# EAGLE design avr-dds-signal-generator-mod (EAGLE 5.09)
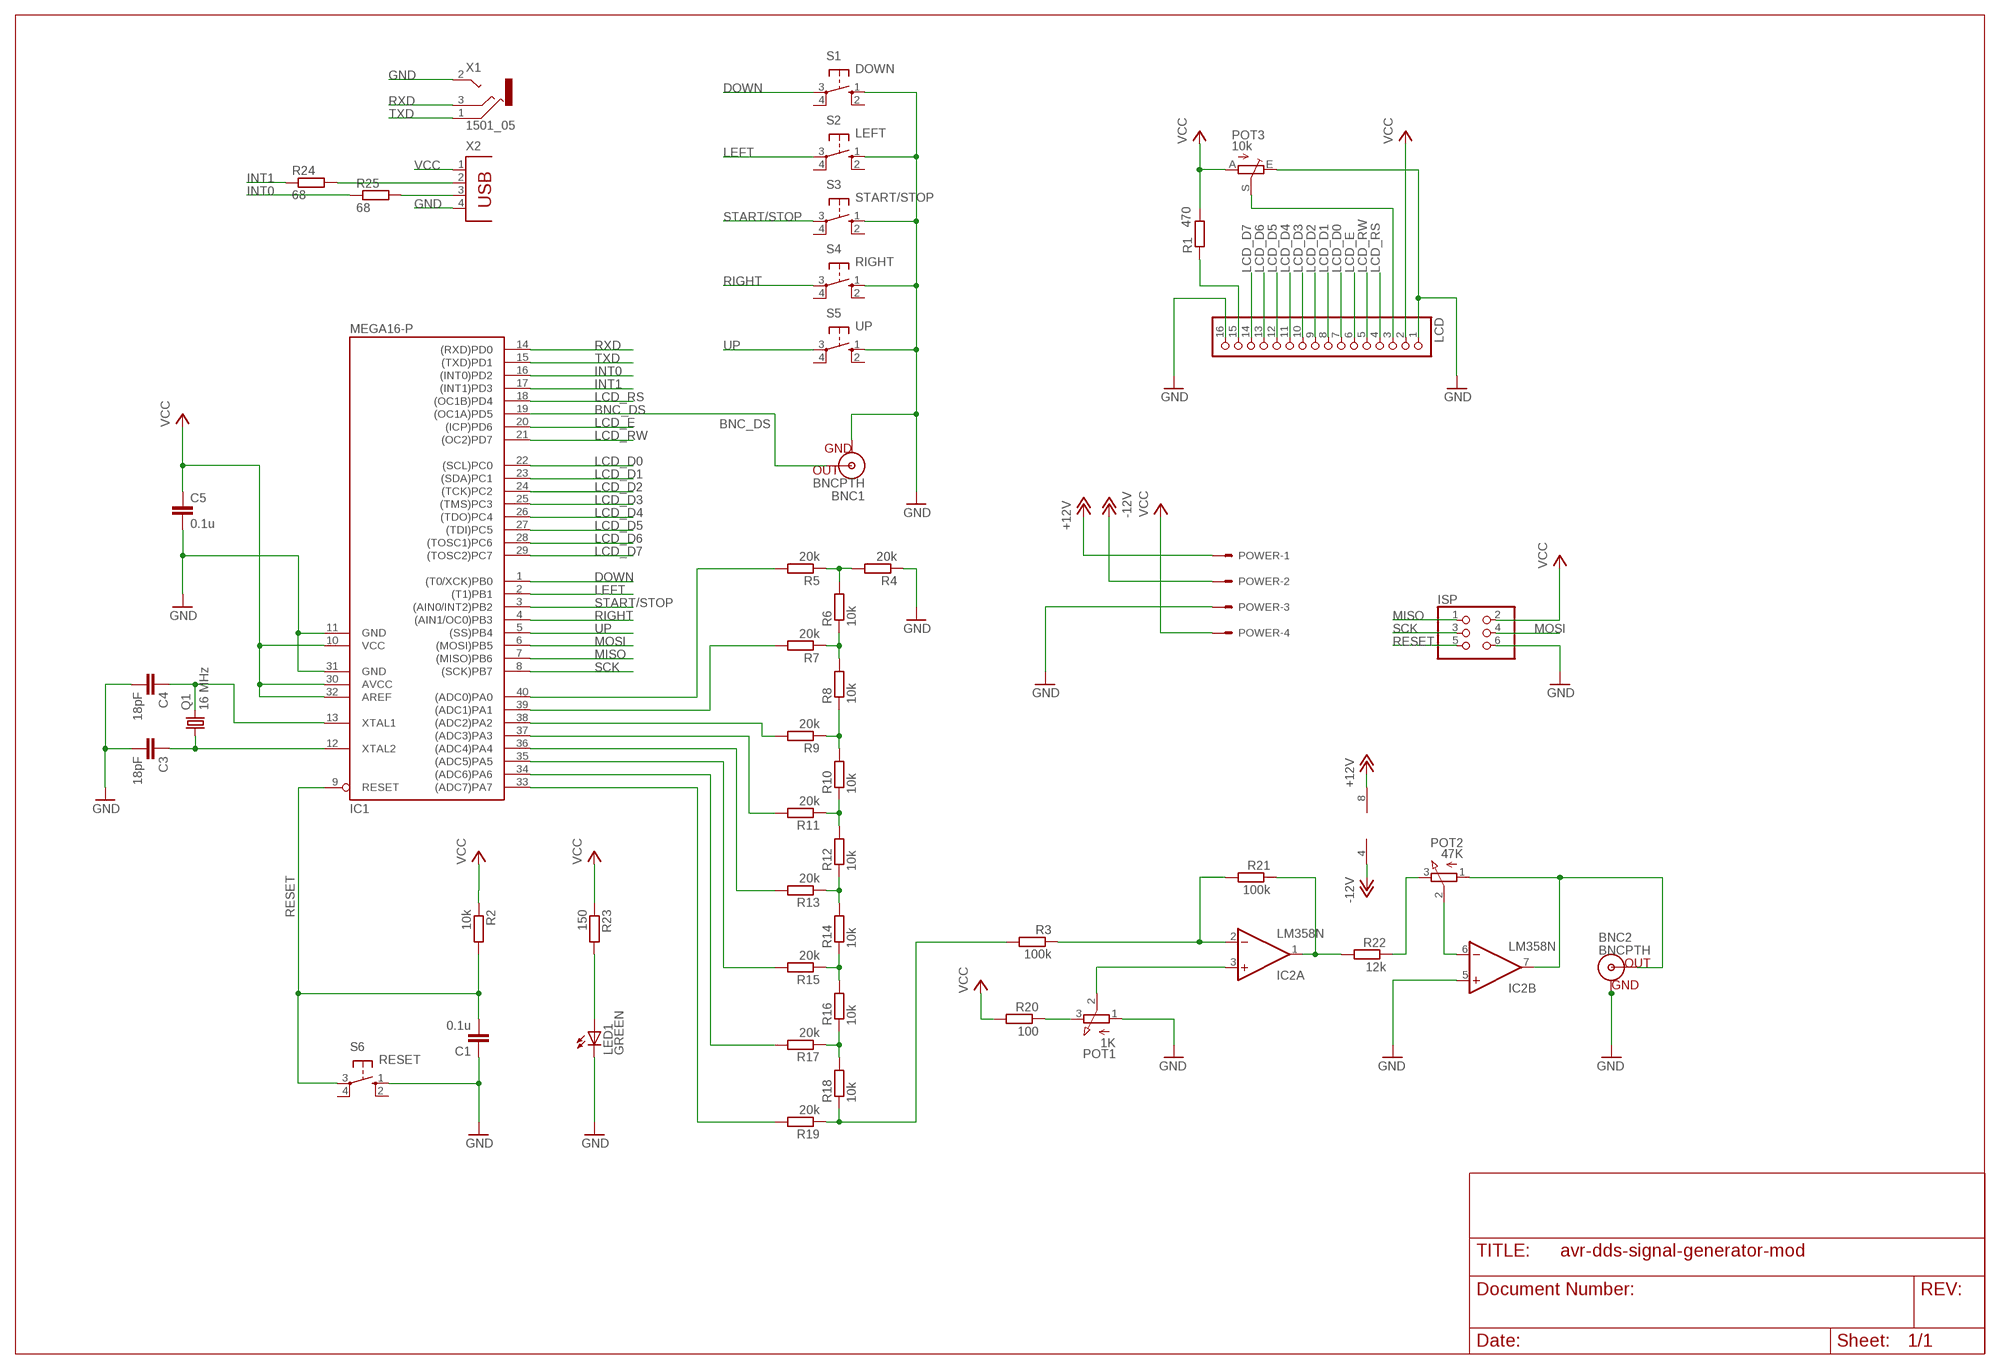
[diagram p0: schematic, sheet 1]

## Parts
BNC1  BNCPTH  [BNC]
BNC2  BNCPTH  [BNC]
C1  0.1u  C-EU050-030X075  [C050-030X075]
C3  18pF  C-EU025-025X050  [C025-025X050]
C4  18pF  C-EU025-025X050  [C025-025X050]
C5  0.1u  C-EUC1206  [C1206]
IC1  MEGA16-P  [DIL40]
IC2  LM358N  [DIL08]
ISP  PINHD-2X3  [2X03]
LCD  PINHD-1X16  [1X16]
LED1  GREEN  LED3MM  [LED3MM]
POT1  1K  3RP/1610N  [3RP/1610N]
POT2  47K  3RP/1610N  [3RP/1610N]
POT3  10k  TRIM_EU-LI10  [LI10]
POWER  22-27-2041-04  [6410-04]
Q1  16 MHz  CRYSTALHC49UV  [HC49U-V]
R1  470  R-EU_0309/12  [0309/12]
R2  10k  R-EU_0207/10  [0207/10]
R3  100k  R-EU_0207/10  [0207/10]
R4  20k  R-EU_0207/10  [0207/10]
R5  20k  R-EU_0207/10  [0207/10]
R6  10k  R-EU_0207/10  [0207/10]
R7  20k  R-EU_0207/10  [0207/10]
R8  10k  R-EU_0207/10  [0207/10]
R9  20k  R-EU_0207/10  [0207/10]
R10  10k  R-EU_0207/10  [0207/10]
R11  20k  R-EU_0207/10  [0207/10]
R12  10k  R-EU_0207/10  [0207/10]
R13  20k  R-EU_0207/10  [0207/10]
R14  10k  R-EU_0207/10  [0207/10]
R15  20k  R-EU_0207/10  [0207/10]
R16  10k  R-EU_0207/10  [0207/10]
R17  20k  R-EU_0207/10  [0207/10]
R18  10k  R-EU_0207/10  [0207/10]
R19  20k  R-EU_0207/10  [0207/10]
R20  100  R-EU_0207/10  [0207/10]
R21  100k  R-EU_0207/10  [0207/10]
R22  12k  R-EU_0207/10  [0207/10]
R23  150  R-EU_0207/10  [0207/10]
R24  68  R-EU_R0805  [R0805]
R25  68  R-EU_R0805  [R0805]
S1  DOWN  10-XX  [B3F-10XX]
S2  LEFT  10-XX  [B3F-10XX]
S3  START/STOP  10-XX  [B3F-10XX]
S4  RIGHT  10-XX  [B3F-10XX]
S5  UP  10-XX  [B3F-10XX]
S6  RESET  10-XX  [B3F-10XX]
X1  1501_05  [1501_05]
X2  PN61729  [PN61729]

## Nets
+12V: IC2.8(P:V+) POWER.1
-12V: IC2.4(P:V-) POWER.2
BNC_DDS: BNC2.S(OUT) IC2.7(B:OUT) POT2.1(A)
BNC_DS: BNC1.S(OUT) IC1.19((OC1A)PD5)
DDS_OUT: R3.2 R18.1 R19.1
DOWN: IC1.1((T0/XCK)PB0) S1.3(P)
GND: BNC1.GND BNC2.GND C1.1 C3.2 C4.2 C5.2 IC1.11(GND) IC1.31(GND) IC2.5(B:+IN) ISP.6 LCD.1 LCD.16 LED1.K(C) POT1.1(A) POT3.E POWER.3 R4.1 S1.1(S) S2.1(S) S3.1(S) S4.1(S) S5.1(S) S6.1(S) X1.2 X2.4
INT0: IC1.16((INT0)PD2) R25.1
INT1: IC1.17((INT1)PD3) R24.1
LCD_D0: IC1.22((SCL)PC0) LCD.7
LCD_D1: IC1.23((SDA)PC1) LCD.8
LCD_D2: IC1.24((TCK)PC2) LCD.9
LCD_D3: IC1.25((TMS)PC3) LCD.10
LCD_D4: IC1.26((TDO)PC4) LCD.11
LCD_D5: IC1.27((TDI)PC5) LCD.12
LCD_D6: IC1.28((TOSC1)PC6) LCD.13
LCD_D7: IC1.29((TOSC2)PC7) LCD.14
LCD_E: IC1.20((ICP)PD6) LCD.6
LCD_RS: IC1.18((OC1B)PD4) LCD.4
LCD_RW: IC1.21((OC2)PD7) LCD.5
LEFT: IC1.2((T1)PB1) S2.3(P)
MISO: IC1.7((MISO)PB6) ISP.1
MOSI: IC1.6((MOSI)PB5) ISP.4
N$1: IC1.40((ADC0)PA0) R5.2
N$2: LCD.3 POT3.S
N$3: IC2.2(A:-IN) R3.1 R21.2
N$4: LED1.A R23.2
N$5: LCD.15 R1.1
N$6: IC1.39((ADC1)PA1) R7.2
N$7: IC1.33((ADC7)PA7) R19.2
N$8: IC1.34((ADC6)PA6) R17.2
N$9: IC1.35((ADC5)PA5) R15.2
N$10: IC1.36((ADC4)PA4) R13.2
N$11: IC1.37((ADC3)PA3) R11.2
N$12: IC1.38((ADC2)PA2) R9.2
N$13: POT2.3(E) R22.1
N$14: IC2.3(A:+IN) POT1.2(S)
N$15: R4.2 R5.1 R6.2
N$16: IC2.1(A:OUT) R21.1 R22.2
N$17: POT1.3(E) R20.1
N$18: R6.1 R7.1 R8.2
N$20: R8.1 R9.1 R10.2
N$21: R10.1 R11.1 R12.2
N$22: R12.1 R13.1 R14.2
N$23: R14.1 R15.1 R16.2
N$24: R16.1 R17.1 R18.2
N$25: IC2.6(B:-IN) POT2.2(S)
N$27: R24.2 X2.2
N$33: R25.2 X2.3
RESET: C1.2 IC1.9(RESET) ISP.5 R2.2 S6.3(P)
RIGHT: IC1.4((AIN1/OC0)PB3) S4.3(P)
RXD: IC1.14((RXD)PD0) X1.3
SCK: IC1.8((SCK)PB7) ISP.3
START/STOP: IC1.3((AIN0/INT2)PB2) S3.3(P)
TXD: IC1.15((TXD)PD1) X1.1
UP: IC1.5((SS)PB4) S5.3(P)
VCC: C5.1 IC1.10(VCC) IC1.30(AVCC) IC1.32(AREF) ISP.2 LCD.2 POT3.A POWER.4 R1.2 R2.1 R20.2 R23.1 X2.1
XTAL1: C4.1 IC1.13(XTAL1) Q1.2
XTAL2: C3.1 IC1.12(XTAL2) Q1.1
Unconnected: S1.2(S1) S1.4(P1) S2.2(S1) S2.4(P1) S3.2(S1) S3.4(P1) S4.2(S1) S4.4(P1) S5.2(S1) S5.4(P1) S6.2(S1) S6.4(P1)

## Library data of the parts
BNC1 BNC2 = SparkFun:BNC: BNC Connector, Mouser Part# 5227161
C1 C3-C5 = rcl:C-EU: CAPACITOR, European symbol
IC1 = atmel:MEGA16-P: MICROCONTROLLER 16 Kbytes FLASH 1 kbytes SRAM 512 bytes EEPROM USART 8-channel 10 bit ADC Source: avr.lbr
IC2 = linear:LM358: OP AMP also LM158; LM258; LM2904 Source: http://cache.national.com/ds/LM/LM158.pdf
ISP = pinhead:PINHD-2X3: PIN HEADER
LCD = pinhead:PINHD-1X16: PIN HEADER
LED1 = led:LED: LED OSRAM: - CHIPLED LG R971, LG N971, LY N971, LG Q971, LY Q971, LO R971, LY R971 LH N974, LH R974 LS Q976, LO Q976, LY Q976 LO Q996 - Hyper CHIPLED LW Q18S LB Q993, LB Q99A, LB R99A - SideLED LS A670, LO A670, LY A670, LG A670, LP A670 LB A673, LV A673, LT A673, LW A673 LH A674 LY A675 LS A676, LA A676, LO A676, LY A676, LW A676 LS A679, LY A679, LG A679 - Hyper Micro SIDELED® LS Y876, LA Y876, LO Y876, LY Y876 LT Y87S - SmartLED LW L88C, LW L88S LB L89C, LB L89S, LG L890 LS L89K, LO L89K, LY L89K LS L896, LA L896, LO L896, LY L896 - TOPLED LS T670, LO T670, LY T670, LG T670, LP T670 LSG T670, LSP T670, LSY T670, LOP T670, LYG T670 LG T671, LOG T671, LSG T671 LB T673, LV T673, LT T673, LW T673 LH T674 LS T676, LA T676, LO T676, LY T676, LB T676, LH T676, LSB T676, LW T676 LB T67C, LV T67C, LT T67C, LS T67K, LO T67K, LY T67K, LW E67C LS E67B, LA E67B, LO E67B, LY E67B, LB E67C, LV E67C, LT E67C LW T67C LS T679, LY T679, LG T679 LS T770, LO T770, LY T770, LG T770, LP T770 LB T773, LV T773, LT T773, LW T773 LH T774 LS E675, LA E675, LY E675, LS T675 LS T776, LA T776, LO T776, LY T776, LB T776 LHGB T686 LT T68C, LB T68C - Hyper Mini TOPLED® LB M676 - Mini TOPLED Santana® LG M470 LS M47K, LO M47K, LY M47K Source: http://www.osram.convergy.de LUXEON: - LUMILED® LXK2-PW12-R00, LXK2-PW12-S00, LXK2-PW14-U00, LXK2-PW14-V00 LXK2-PM12-R00, LXK2-PM12-S00, LXK2-PM14-U00 LXK2-PE12-Q00, LXK2-PE12-R00, LXK2-PE12-S00, LXK2-PE14-T00, LXK2-PE14-U00 LXK2-PB12-K00, LXK2-PB12-L00, LXK2-PB12-M00, LXK2-PB14-N00, LXK2-PB14-P00, LXK2-PB14-Q00 LXK2-PR12-L00, LXK2-PR12-M00, LXK2-PR14-Q00, LXK2-PR14-R00 LXK2-PD12-Q00, LXK2-PD12-R00, LXK2-PD12-S00 LXK2-PH12-R00, LXK2-PH12-S00 LXK2-PL12-P00, LXK2-PL12-Q00, LXK2-PL12-R00 Source: www.luxeon.com KINGBRIGHT: KA-3528ASYC Source: www.kingbright.com
POT1 POT2 = pot:3RP/1610N: 16mm Potentiometer one level Source: http://www.alphapotentiometers.net/html/16mm_pot_2.html
POT3 = pot:TRIM_EU-: POTENTIOMETER
POWER = con-molex:22-?-04: CONNECTOR wire to board 2.54 mm (.1 inch) pitch header
Q1 = SparkFun:CRYSTAL: Crystals Various standard crystals. Proven footprints. Spark Fun Electronics SKU : COM-00534
R1-R25 = rcl:R-EU_: RESISTOR, European symbol
S1-S6 = switch-omron:10-XX: OMRON SWITCH
X1 = con-lumberg:1501_0*: Jack connectors according to JISC 6560, 2.5 mm Klinkensteckverbinder nach JISC 6560, 2,5 mm Source: http://www.lumberg.com/Produkte/PDFs/1501_05.pdfedit 1501_03 http://www.lumberg.com/Produkte/PDFs/1501_06.pdf
X2 = con-berg:PN61729: BERG USB connector

## Board
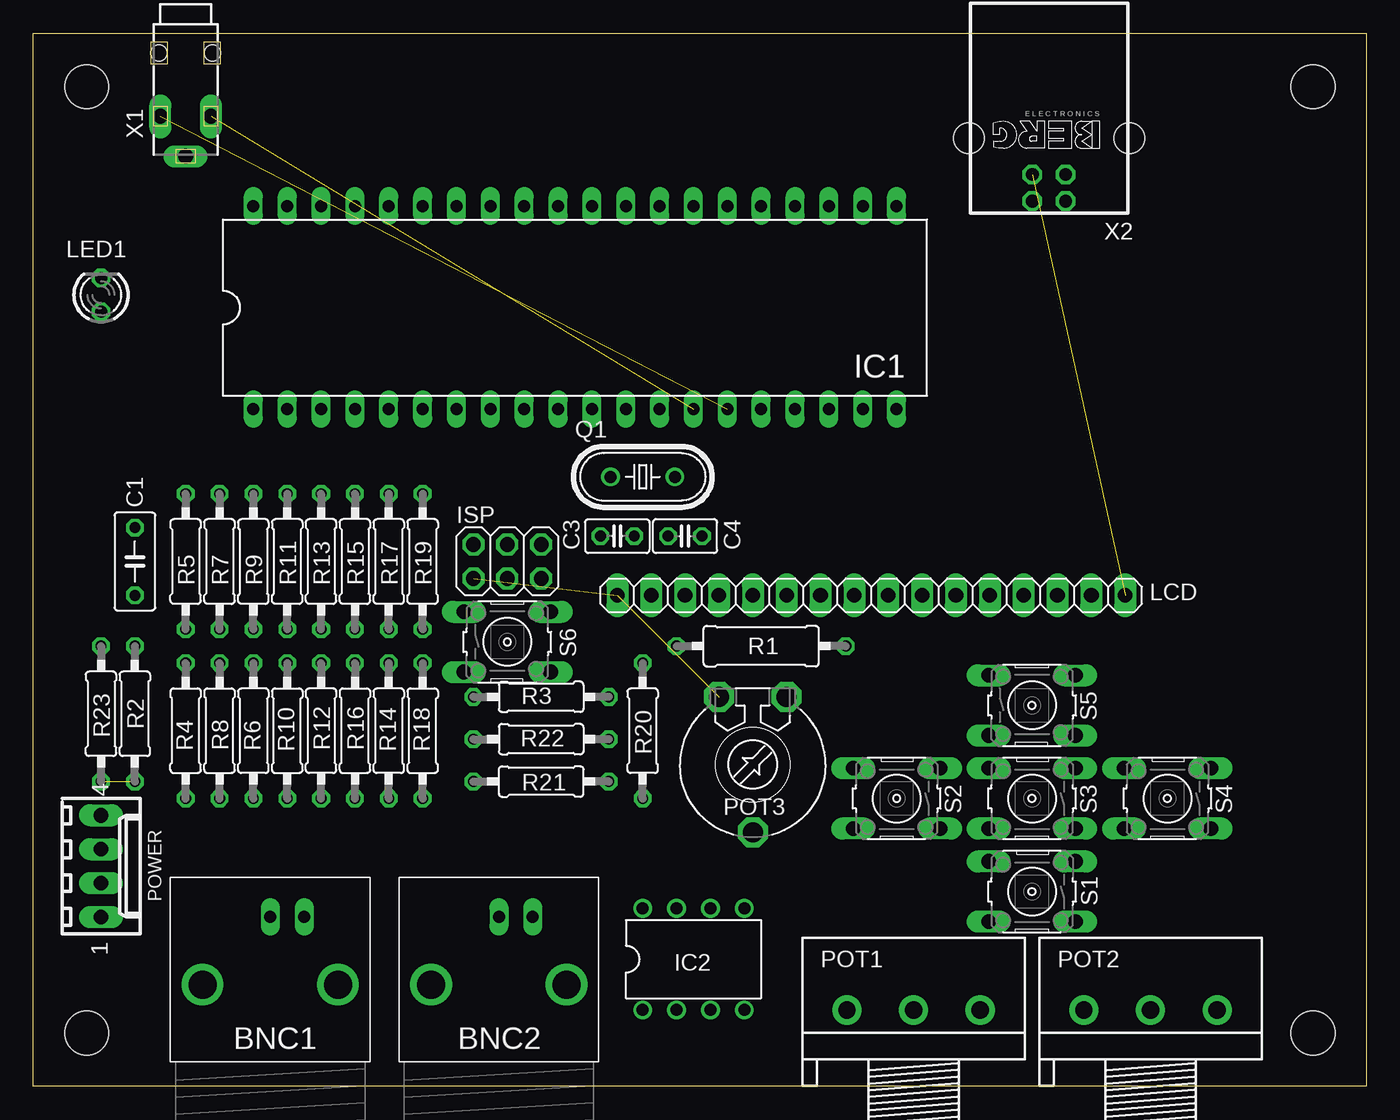
[diagram p1: board, top side]
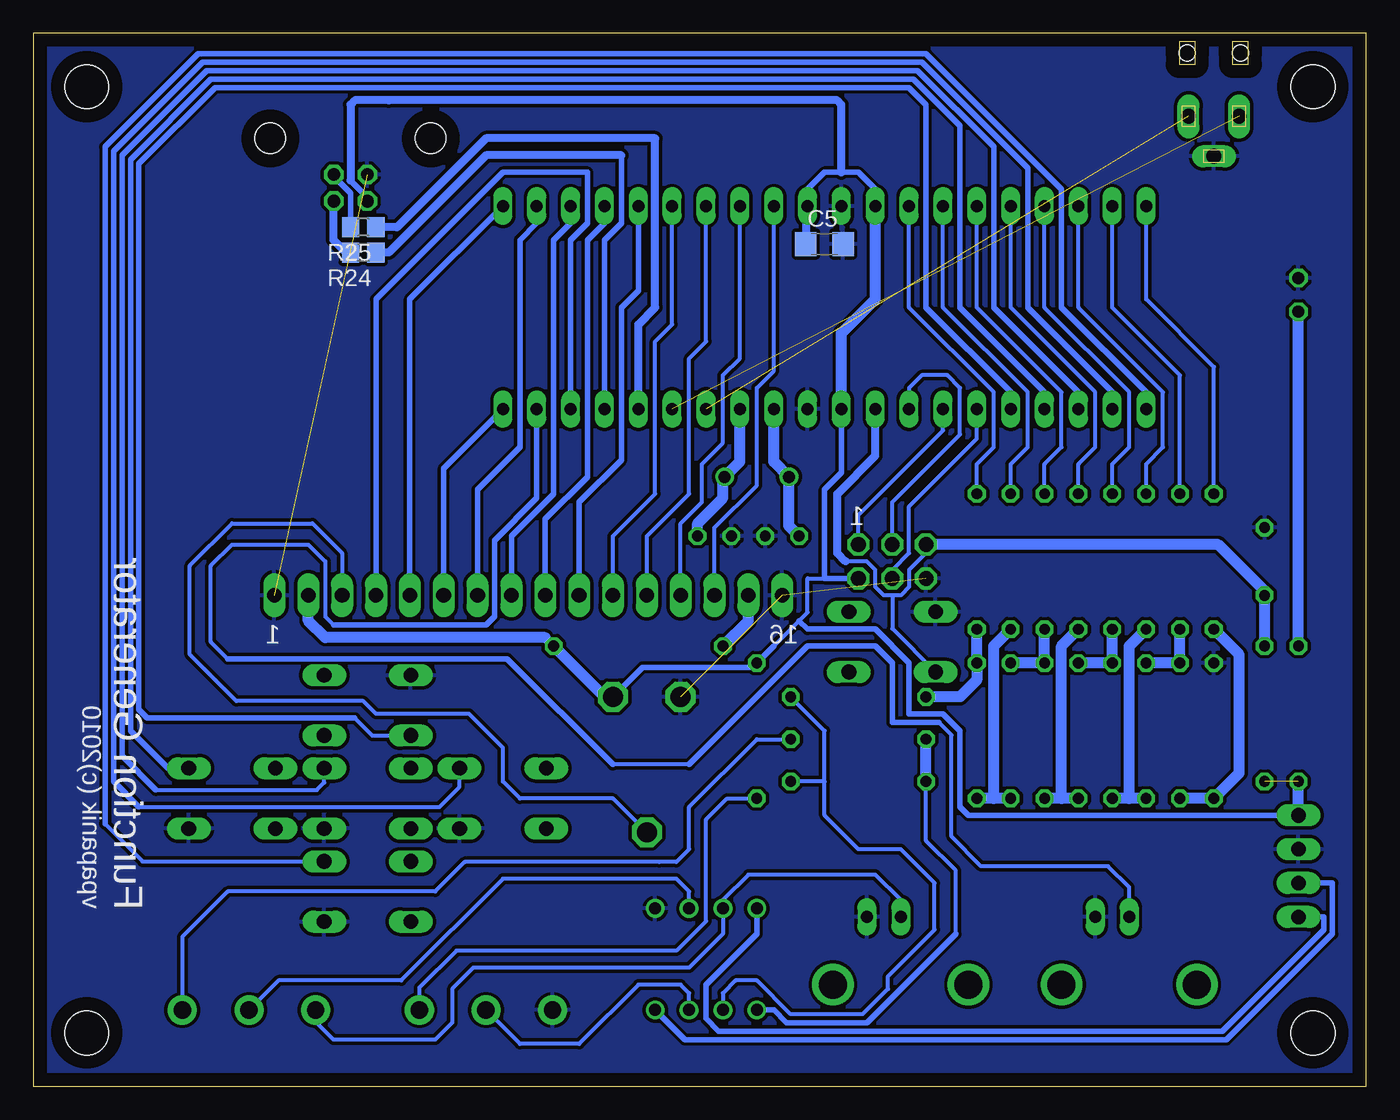
[diagram p2: board, bottom side, seen from below]

Size 100 x 79 mm. Coordinates in mm from the lower left corner, seen from the top.
Outline: 0,79 100,79 100,0 0,0 0,79
Copper layers (1*16): Top 0.035mm / dielectric 1.5mm / Bottom 0.035mm
Design rules "OLIMEX_10mils": minimum track width 10mil, minimum drill 24mil, track to track 10mil, track to pad 10mil, pad to pad 10mil, via to via 10mil, smd to smd 10mil, copper to edge 40mil, drill to drill 10mil, minimum pad ring 10mil, minimum via ring 8mil, stop-mask expansion 0mil, vias tented up to drill 0mil, thermal gap 10mil
Holes 3.3 mm at 4,75 96,75 96,4 4,4

### Footprints (pad centres in the part's own frame; a part is rotated, then mirrored left to right if it is on the bottom)
BNC = drill 2.1 round: 3 -5.08,5.08; 4 5.08,5.08 | drill 0.9 long: GND -2.54,0; S 0,0
C050-030X075 = drill 0.813 octagon: 1 -2.54,0; 2 2.54,0
C025-025X050 = drill 0.813 octagon: 1 -1.27,0; 2 1.27,0
C1206 = smd 1.6 x 1.8: 1 -1.4,0; 2 1.4,0
DIL40 = drill 0.9 long: 1 -24.13,-7.62; 2 -21.59,-7.62; 3 -19.05,-7.62; 4 -16.51,-7.62; 5 -13.97,-7.62; 6 -11.43,-7.62; 7 -8.89,-7.62; 8 -6.35,-7.62; 9 -3.81,-7.62; 10 -1.27,-7.62; 11 1.27,-7.62; 12 3.81,-7.62; 13 6.35,-7.62; 14 8.89,-7.62; 15 11.43,-7.62; 16 13.97,-7.62; 17 16.51,-7.62; 18 19.05,-7.62; 19 21.59,-7.62; 20 24.13,-7.62; 21 24.13,7.62; 22 21.59,7.62; 23 19.05,7.62; 24 16.51,7.62; 25 13.97,7.62; 26 11.43,7.62; 27 8.89,7.62; 28 6.35,7.62; 29 3.81,7.62; 30 1.27,7.62; 31 -1.27,7.62; 32 -3.81,7.62; 33 -6.35,7.62; 34 -8.89,7.62; 35 -11.43,7.62; 36 -13.97,7.62; 37 -16.51,7.62; 38 -19.05,7.62; 39 -21.59,7.62; 40 -24.13,7.62
DIL08 = drill 0.9 pad 1.27 round: 1 -3.81,-3.81; 2 -1.27,-3.81; 3 1.27,-3.81; 4 3.81,-3.81; 5 3.81,3.81; 6 1.27,3.81; 7 -1.27,3.81; 8 -3.81,3.81
2X03 = drill 1.1 octagon: 1 -2.54,-1.27; 2 -2.54,1.27; 3 0,-1.27; 4 0,1.27; 5 2.54,-1.27; 6 2.54,1.27
1X16 = drill 1.1 long: 1 -19.05,0; 2 -16.51,0; 3 -13.97,0; 4 -11.43,0; 5 -8.89,0; 6 -6.35,0; 7 -3.81,0; 8 -1.27,0; 9 1.27,0; 10 3.81,0; 11 6.35,0; 12 8.89,0; 13 11.43,0; 14 13.97,0; 15 16.51,0; 16 19.05,0
LED3MM = drill 0.9 octagon: A -1.27,0; K 1.27,0
3RP/1610N = drill 1.3 pad 2.184 round: 1 -5,0; 2 0,0; 3 5,0
LI10 = drill 1.5 octagon: A -2.54,-5.08; E 2.54,-5.08; S 0,5.08
6410-04 = drill 1.1 long: 1 3.81,0; 2 1.27,0; 3 -1.27,0; 4 -3.81,0
HC49U-V = drill 0.9 round: 1 -2.413,0; 2 2.413,0
0309/12 = drill 0.813 octagon: 1 -6.35,0; 2 6.35,0
0207/10 = drill 0.813 octagon: 1 -5.08,0; 2 5.08,0
R0805 = smd 1.3 x 1.5: 1 -0.95,0; 2 0.95,0
B3F-10XX = drill 1.1 long: 1 -3.251,2.261; 2 3.251,2.261; 3 -3.251,-2.261; 4 3.251,-2.261
1501_05 = drill 1.1 pad 1.4 long: 1 -1.9,-8.5; 2 0,-11.5; 3 1.9,-8.5 | hole 1.2: -2,-3.75; 2,-3.75
PN61729 = drill 0.95 octagon: 1 1.25,4.71; 2 -1.25,4.71; 3 -1.25,2.71; 4 1.25,2.71 | hole 2.3: -6.02,0; 6.02,0

### Placement (x,y rotation side)
BNC1  17.78,12.7 180 top
BNC2  34.92,12.7 180 top
C1  7.62,39.37 270 top
C3  43.81,41.27 0 top
C4  48.9,41.27 180 top
C5  40.64,63.18 0 bottom
IC1  40.64,58.42 0 top
IC2  49.53,9.53 0 top
ISP  35.56,39.37 180 top
LCD  62.87,36.83 180 top
LED1  5.08,59.37 90 top
POT1  66.04,5.71 0 top
POT2  83.82,5.71 0 top
POT3  53.98,24.13 180 top
POWER  5.08,16.51 270 top
Q1  45.72,45.72 0 top
R1  54.61,33.02 0 top
R2  7.62,27.94 90 top
R3  38.1,29.21 180 top
R4  11.43,26.67 270 top
R5  11.43,39.37 90 top
R6  13.97,26.67 270 top
R7  13.97,39.37 90 top
R8  16.51,26.67 90 top
R9  16.51,39.37 90 top
R10  19.05,26.67 270 top
R11  19.05,39.37 90 top
R12  21.59,26.67 90 top
R13  21.59,39.37 90 top
R14  24.13,26.67 270 top
R15  24.13,39.37 90 top
R16  26.67,26.67 90 top
R17  26.67,39.37 90 top
R18  29.21,26.67 270 top
R19  29.21,39.37 90 top
R20  45.72,26.67 90 top
R21  38.1,22.86 0 top
R22  38.1,26.04 180 top
R23  5.08,27.94 90 top
R24  75.25,62.55 180 bottom
R25  75.25,64.45 180 bottom
S1  74.93,14.61 180 top
S2  64.77,21.59 180 top
S3  74.93,21.59 180 top
S4  85.09,21.59 180 top
S5  74.93,28.57 0 top
S6  35.56,33.34 0 top
X1  11.43,81.28 0 top
X2  76.2,71.12 180 top

### Tracks (layer width: path | path; a pad name or v marks a point on that pad's centre or on a via)
+12V
  Bottom 0.406: IC2.8 45.72,11.43 49.53,7.62 49.53,5.08 48.58,4.13 10.79,4.13 3.17,11.75 3.17,12.7 POWER.1
-12V
  Bottom 0.406: POWER.2 2.54,15.24 2.54,11.43 10.48,3.49 51.12,3.49 IC2.4
BNC_DDS
  Bottom 0.305: BNC2.S 34.92,13.97 36.83,15.88 46.35,15.88 48.26,13.97 IC2.7 48.26,11.43 50.8,8.89 66.99,8.89 68.58,7.3 68.58,4.76 69.85,3.49 77.47,3.49 78.82,4.84 POT2.1
BNC_DS
  Bottom 0.305: BNC1.S 17.78,14.92 19.37,16.51 28.89,16.51 31.11,18.73 31.11,26.35 32.07,27.3 | 50.8,24.13 56.52,24.13 | 85.41,32.07 86.68,33.34 86.68,39.05 85.09,40.64 79.38,40.64 78.11,39.37 78.11,35.24 77.47,34.61
  Bottom 0.406: IC1.19 62.23,44.13 65.41,40.96 65.41,35.24 66.04,34.61 77.47,34.61 | 50.8,24.13 41.91,33.02 36.83,33.02 35.56,31.75 35.56,27.3 32.07,27.3 | 85.41,32.07 64.45,32.07 56.52,24.13
DDS_OUT
  Bottom 0.813: R19.1 R18.1 29.21,30.48 30.48,29.21 R3.2
DOWN
  Bottom 0.305: S1.3 91.8,16.87 94.61,19.68
  Bottom 0.406: IC1.1 16.51,52.07 22.86,58.42 22.86,67.31 33.02,77.47 87.63,77.47 94.61,70.48 94.61,19.68
GND  (3 unrouted)
  pour Bottom (isolate 0.254): 0,0 100,0 100,79 0,79
INT0
  Bottom 0.61: IC1.16 54.61,57.15 53.34,58.42 53.34,71.12 66.04,71.12 72.71,64.45 R25.1
INT1
  Bottom 0.406: IC1.17 57.15,63.5 55.88,64.77 55.88,69.85
  Bottom 0.61: 55.88,69.85 66.04,69.85 73.34,62.55 R24.1
LCD_D0
  Bottom 0.406: LCD.7 66.67,44.77 63.5,47.94 63.5,63.5 62.23,64.77 IC1.22
LCD_D1
  Bottom 0.406: LCD.8 64.14,41.27 60.96,44.45 60.96,63.5 59.69,64.77 IC1.23
LCD_D2
  Bottom 0.406: LCD.9 61.59,42.55 58.42,45.72 58.42,63.5 57.15,64.77 IC1.24
LCD_D3
  Bottom 0.406: LCD.10 59.05,43.81 55.88,46.99 55.88,58.42 54.61,59.69 IC1.25
LCD_D4
  Bottom 0.305: IC1.26 52.07,57.15 53.34,55.88 53.34,44.45 56.52,41.27 LCD.11
LCD_D5
  Bottom 0.305: IC1.27 49.53,55.88 50.8,54.61 50.8,44.45 53.98,41.27 LCD.12
LCD_D6
  Bottom 0.305: IC1.28 46.99,54.61 48.26,53.34 48.26,48.26 49.85,46.67 49.85,43.81 51.44,42.23 LCD.13
LCD_D7
  Bottom 0.305: IC1.29 44.45,53.66 45.72,52.39 45.72,45.09 48.9,41.91 LCD.14
LCD_E
  Bottom 0.406: LCD.6 69.22,45.72 69.22,46.35 IC1.20
LCD_RS
  Bottom 0.406: LCD.4 74.3,59.05 64.77,68.58 58.42,68.58 58.42,64.77 59.69,63.5 IC1.18
LCD_RW
  Bottom 0.406: LCD.5 71.75,59.05 IC1.21
LEFT
  Bottom 0.305: S2.3 68.02,22.47 69.53,20.95 92.08,20.95
  Bottom 0.406: IC1.2 19.05,52.07 25.4,58.42 25.4,68.9 33.34,76.83 87.31,76.83 93.98,70.17 93.98,22.86 92.08,20.95
MISO
  Bottom 0.305: IC1.7 31.75,49.21 38.1,42.86 ISP.1
MOSI
  Bottom 0.305: IC1.6 29.21,48.58 34.29,43.5 34.29,40.01 35.56,38.73 ISP.4
N$1
  Bottom 0.305: R5.2 11.43,53.98 16.51,59.05 IC1.40
N$2
  Bottom 0.305: POT3.S 56.52,21.59 63.5,21.59 64.77,22.86 64.77,25.4 67.31,27.94 74.3,27.94 75.25,28.89 84.77,28.89 88.27,32.38 88.27,39.05 85.09,42.23 79.06,42.23 76.83,40.01 LCD.3
N$3
  Bottom 0.305: R3.1 40.64,26.67 40.64,22.86 | 40.64,22.86 R21.2 | 40.64,22.86 40.64,20.32 38.1,17.78 34.92,17.78 32.38,15.24 32.38,11.75 35.88,8.26 35.88,7.3 37.78,5.4 43.18,5.4 45.72,7.94 47.31,7.94 48.26,6.99 IC2.2
N$4
  Bottom 0.813: R23.2 LED1.A
N$5
  Bottom 0.813: LCD.15 46.35,34.92 R1.1
N$6
  Bottom 0.305: R7.2 13.97,53.34 19.05,58.42 IC1.39
N$7
  Bottom 0.305: R19.2 29.21,46.67 27.94,47.94 27.94,52.07 34.29,58.42 IC1.33
N$8
  Bottom 0.305: R17.2 26.67,46.67 25.4,47.94 25.4,52.07 31.75,58.42 IC1.34
N$9
  Bottom 0.305: R15.2 24.13,46.67 22.86,47.94 22.86,52.07 29.21,58.42 IC1.35
N$10
  Bottom 0.305: R13.2 21.59,46.67 20.32,47.94 20.32,52.07 26.67,58.42 IC1.36
N$11
  Bottom 0.305: R11.2 19.05,46.67 17.78,47.94 17.78,52.07 24.13,58.42 IC1.37
N$12
  Bottom 0.305: R9.2 16.51,46.67 15.24,47.94 15.24,52.07 21.59,58.42 IC1.38
N$13
  Bottom 0.305: POT2.3 88.82,11.19 85.41,14.61 69.85,14.61 67.63,16.83 53.02,16.83 51.75,16.83 50.8,17.78 50.8,20.95 45.72,26.04 R22.1
N$14
  Bottom 0.305: IC2.3 50.8,6.99 51.44,7.62 54.61,7.62 59.05,3.17 63.5,3.17 POT1.2
N$15
  Bottom 0.813: R5.1 9.53,32.38 9.53,23.5 R4.2 R6.2
N$16
  Bottom 0.305: 30.8,11.43 30.8,16.19 33.02,18.41 R21.1
  Bottom 0.406: IC2.1 44.45,5.71 43.5,4.76 37.47,4.76 30.8,11.43
  Bottom 0.813: R21.1 R22.2
N$17
  Bottom 0.305: POT1.3 71.04,7.38 68.26,10.16 51.75,10.16 49.53,12.38 49.53,20 47.94,21.59 R20.1
N$18
  Bottom 0.813: R7.1 R6.1 R8.2
N$20
  Bottom 0.813: R9.1 17.78,33.02 17.78,21.59 | R8.1 17.78,21.59 | 17.78,21.59 R10.2
N$21
  Bottom 0.813: R11.1 R10.1 R12.2
N$22
  Bottom 0.813: R13.1 22.86,33.02 22.86,21.59 | R12.1 22.86,21.59 | 22.86,21.59 R14.2
N$23
  Bottom 0.813: R15.1 R14.1 R16.2
N$24
  Bottom 0.813: R17.1 27.94,33.02 27.94,21.59 | R16.1 27.94,21.59 | 27.94,21.59 R18.2
N$25
  Bottom 0.305: IC2.6 50.8,14.61 51.75,15.56 64.77,15.56 72.39,7.94 81.6,7.94 POT2.2
N$27
  Bottom 0.61: X2.2 77.47,66.39 77.47,63.5 76.52,62.55 R24.2
N$33
  Bottom 0.406: R25.2 76.2,66.99 77.45,68.24 X2.3
  Bottom 0.61: R25.2
RESET
  Bottom 0.305: 39.05,39.37 37.47,39.37 36.83,38.73 36.83,37.47 36.2,36.83 35.56,36.83 | 35.56,36.83 34.92,36.83 34.29,37.47 34.29,38.73 33.02,40.01 ISP.5 | S6.3 35.56,34.33 35.56,36.83
  Bottom 0.406: R2.2 C1.2
  Bottom 0.61: IC1.9 36.83,47.31 39.69,44.45 39.69,40.01 39.05,39.37
  Bottom 0.813: R2.2 7.62,37.15 11.11,40.64 ISP.5
RIGHT
  Bottom 0.305: 89.89,23.85 S4.3
  Bottom 0.406: IC1.4 24.13,52.07 30.48,58.42 30.48,72.07 33.97,75.56 86.68,75.56 92.71,69.53 92.71,26.67 89.89,23.85
RXD  (1 unrouted)
SCK
  Bottom 0.305: ISP.3 35.56,43.81 30.48,48.9 30.48,52.39 31.43,53.34 33.34,53.34 34.29,52.39 IC1.8
START/STOP
  Bottom 0.305: S3.3 78.18,22.78 78.74,22.23 90.81,22.23
  Bottom 0.406: IC1.3 21.59,52.07 27.94,58.42 27.94,70.48 33.66,76.2 87,76.2 93.34,69.85 93.34,24.77 90.81,22.23
TXD  (1 unrouted)
UP
  Bottom 0.305: S5.3 74.57,26.31 75.88,27.62
  Bottom 0.406: IC1.5 26.67,52.07 33.02,58.42 33.02,73.66 34.29,74.93 86.36,74.93 92.08,69.22 92.08,28.26 91.44,27.62 75.88,27.62
VCC  (1 unrouted)
  Bottom 0.305: 40.64,38.1 41.91,38.1 41.91,35.56 42.55,34.92 44.45,33.02
  Bottom 0.406: IC1.10 39.37,46.04 40.64,44.77 40.64,38.1 ISP.2 | R1.2 61.59,33.66 | 44.45,33.02 R20.2 46.04,31.43 54.29,31.43 POT3.A | POWER.4 29.84,20.32 30.48,20.95 30.48,26.67 31.75,27.94 34.29,27.94 34.29,31.75 36.83,34.29 41.91,34.29 42.55,34.92 | IC1.30 41.91,67.31 40.64,68.58 39.37,68.58 38.1,68.58 36.83,67.31 IC1.32 | 74.93,66.43 74.93,66.67 76.2,67.94
  Bottom 0.61: IC1.30 42.04,66.04 C5.1 | 39.37,68.58 39.37,73.66 39.69,73.98 73.34,73.98 75.88,73.98 76.2,73.66 76.2,67.94 | 74.93,66.43 X2.1
  Bottom 0.813: POT3.A 57.15,29.21 R1.2 | LCD.2 79.38,34.92 78.11,33.66 61.59,33.66 | IC1.10 39.37,56.52 36.83,59.05 IC1.32 | POWER.4 R23.1
XTAL1
  Bottom 0.305: 48.26,45.59 Q1.2
  Bottom 0.813: IC1.13 46.99,46.86 Q1.2 | C4.1 50.16,42.23 48.26,44.13 48.26,45.59
XTAL2
  Bottom 0.813: IC1.12 44.45,46.86 Q1.1 43.31,42.04 C3.1

### Text on the board
bNames: 1 | Function Generator | 16 | 1 | vpapanik (c)2010